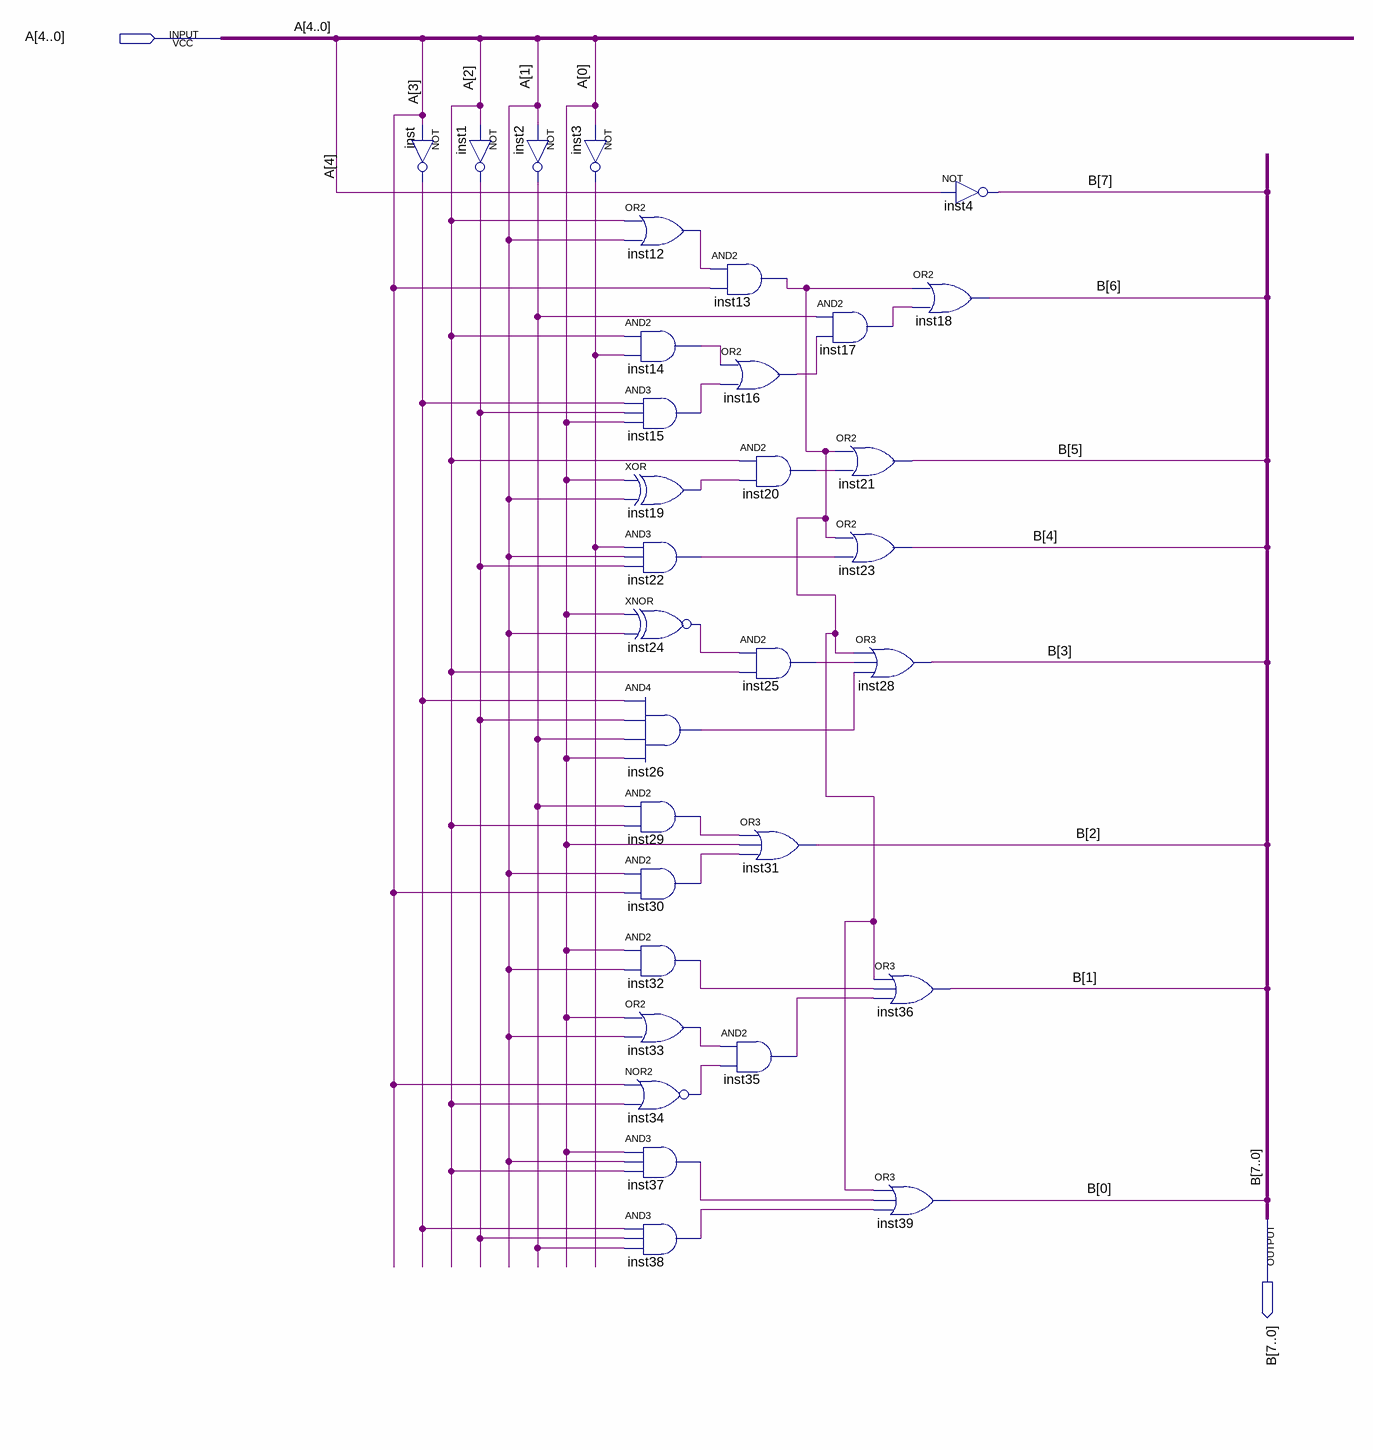
[diagram p0: schematic sheet]
// Quartus schematic aura.bdf as structural Verilog: 32 symbols, 2 pins
module aura (
  input  [4:0] A,
  output [7:0] B
);

  wire inst1_out, inst2_out, inst3_out, inst12_out, inst13_out, inst14_out, inst15_out, inst16_out,
       inst17_out, inst19_out, inst20_out, inst22_out, inst24_out, inst25_out, inst26_out, inst29_out,
       inst30_out, inst32_out, inst33_out, inst34_out, inst35_out, inst37_out, inst38_out, inst_out;

  not inst (inst_out, A[3]);
  not inst1 (inst1_out, A[2]);
  not inst2 (inst2_out, A[1]);
  not inst3 (inst3_out, A[0]);
  or inst12 (inst12_out, A[2], A[1]);
  and inst14 (inst14_out, A[2], inst3_out);
  and inst15 (inst15_out, inst_out, inst1_out, A[0]);
  xor inst19 (inst19_out, A[0], A[1]);
  and inst22 (inst22_out, inst3_out, A[1], inst1_out);
  xnor inst24 (inst24_out, A[0], A[1]);
  and inst26 (inst26_out, inst_out, inst1_out, inst2_out, A[0]);
  and inst29 (inst29_out, inst2_out, A[2]);
  and inst30 (inst30_out, A[1], A[3]);
  and inst32 (inst32_out, A[0], A[1]);
  or inst33 (inst33_out, A[0], A[1]);
  nor inst34 (inst34_out, A[3], A[2]);
  and inst37 (inst37_out, A[0], A[1], A[2]);
  and inst38 (inst38_out, inst_out, inst1_out, inst2_out);
  and inst13 (inst13_out, inst12_out, A[3]);
  or inst16 (inst16_out, inst14_out, inst15_out);
  and inst20 (inst20_out, A[2], inst19_out);
  and inst25 (inst25_out, inst24_out, A[2]);
  or inst31 (B[2], inst29_out, A[0], inst30_out);
  and inst35 (inst35_out, inst33_out, inst34_out);
  and inst17 (inst17_out, inst2_out, inst16_out);
  or inst21 (B[5], inst13_out, inst20_out);
  or inst23 (B[4], inst13_out, inst22_out);
  or inst28 (B[3], inst13_out, inst25_out, inst26_out);
  not inst4 (B[7], A[4]);
  or inst18 (B[6], inst13_out, inst17_out);
  or inst36 (B[1], inst13_out, inst32_out, inst35_out);
  or inst39 (B[0], inst13_out, inst37_out, inst38_out);
endmodule
